# EAGLE design Maduino Power Line Modem  v1.2 (EAGLE 6.1)
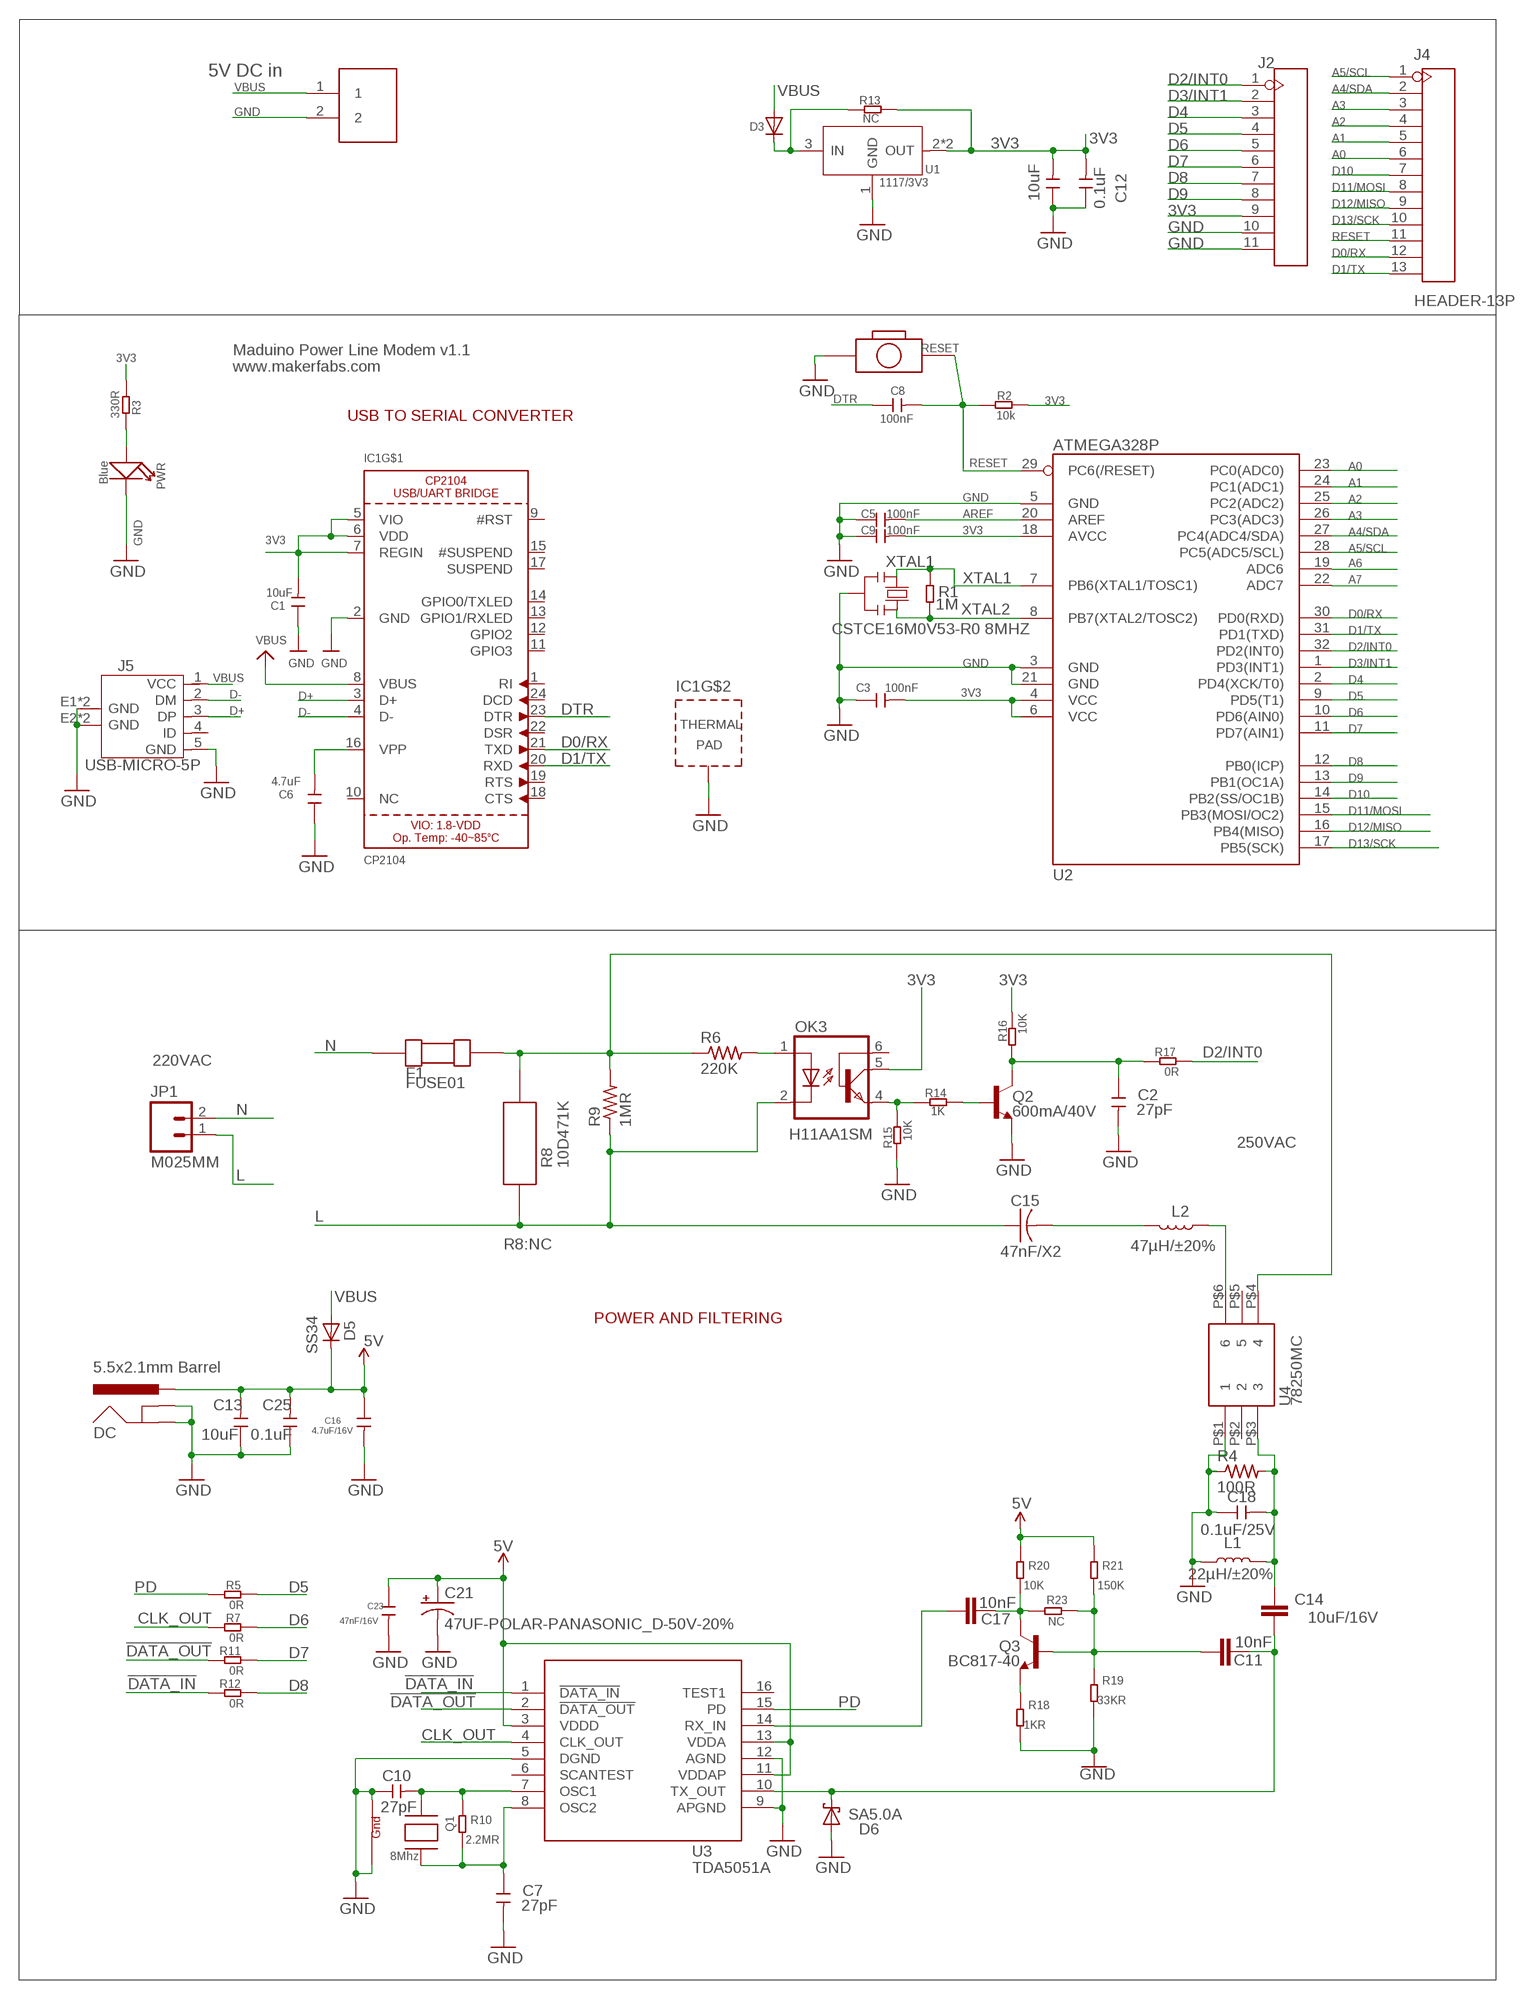
[diagram p0: schematic, sheet 1]

## Parts
C1  10uF  C-0603  [0603]
C2  27pF  C-0603  [0603]
C3  100nF  C-0603  [0603]
C4  10uF  C-0603  [0603]
C5  100nF  C-0603  [0603]
C6  4.7uF  C-0603  [0603]
C7  27pF  C-0603  [0603]
C8  100nF  C-0603  [0603]
C9  100nF  C-0603  [0603]
C10  27pF  C-0603  [0603]
C11  10nF  10NF-0603-50V-10%  [0603]
C12  0.1uF  C-0603  [0603]
C13  10uF  C-0603  [0603]
C14  10uF/16V  10NF-0603-50V-10%  [0603]
C15  47nF/X2  C-US150-054X183  [C150-054X183]
C16  4.7uF/16V  C-0603  [0603]
C17  10nF  10NF-0603-50V-10%  [0603]
C18  0.1uF/25V  C-0603  [0603]
C21  47UF-POLAR-PANASONIC_D-50V-20%  [PANASONIC_D]
C23  47nF/16V  C-0603  [0603]
C25  0.1uF  C-0603  [0603]
D3  DIODESOD-323F  [SOD-323F]
D5  SS34  DIODE-DO-214AC  [DO-214AC]
D6  SA5.0A  SCHOTTKY-DIODEDO41  [DO41-10]
DC  5.5x2.1mm Barrel  POWER_JACKSMD  [POWER_JACK_SMD]
F1  FUSE01  [FUSE01]
IC1  CP2104  [QFN24_4MM_SMSC]
J1  PH2.0-2P-90-DIP  [PH2.0-2P-90-DIP]
J2  HEADER-11P-2.54  [11P-2.54]
J4  HEADER-13P  [13P-2.54]
J5  USB-MICRO-5P  [MICRO-USB-5P]
JP1  M025MM  [SCREWTERMINAL-5MM-2]
L1  22µH/±20%  INDUCTOR-CR75-68UH  [CR75]
L2  47µH/±20%  INDUCTOR-CR75-68UH  [CR75]
OK3  H11A1SM  [DIL6-SMD]
PWR  Blue  LED'0603'  [LED-0603]
Q1  8Mhz  XTAL-4-3225  [NX3225]
Q2  600mA/40V  TRANS_NPN-MMBT2222AL  [SOT23-3]
Q3  BC817-40  TRANS_NPN-MMBTA42  [SOT23-3]
R1  1M  R-0603  [R0603]
R2  10k  R-0603  [R0603]
R3  330R  R-0603  [R0603]
R4  100R  R-US_R1206  [R1206]
R5  0R  R-0603  [R0603]
R6  220K  R-US_R1206  [R1206]
R7  0R  R-0603  [R0603]
R8  10D471K  [DIP2-7.5MM]
R9  1MR  R-US_R1206  [R1206]
R10  2.2MR  R-0603  [R0603]
R11  0R  R-0603  [R0603]
R12  0R  R-0603  [R0603]
R13  NC  R-0603  [R0603]
R14  1K  R-0603  [R0603]
R15  10K  R-0603  [R0603]
R16  10K  R-0603  [R0603]
R17  0R  R-0603  [R0603]
R18  1KR  R-0603  [R0603]
R19  33KR  R-0603  [R0603]
R20  10K  R-0603  [R0603]
R21  150K  R-0603  [R0603]
R23  NC  R-0603  [R0603]
RESET  BOTTON-2P-90D  [2P-7.62X3.56-90D]
U1  1117/3V3  LD1117'SOT89'  [SOT89]
U2  ATMEGA328P  ATMEGA8/168/328  [TQFP32]
U3  TDA5051A  [SOT-162]
U4  78250MC  [SMD6-254-1270X900]
Y1  CSTCE16M0V53-R0 8MHZ  RESONATORMU  [RESONATOR]

## Nets
3V3: C1.2 C3.2 C4.2 C9.2 C12.2 IC1.5(VIO) IC1.6(VDD) IC1.7(REGIN) J2.9 OK3.5(COL) R2.1 R3.1 R13.1 R16.1 U1.2(OUT) U1.4(OUT) U2.4(VCC) U2.6(VCC) U2.18(AVCC)
5V: C13.2 C16.1 C21.+ C23.1 C25.2 D5.C DC.VIN0(PWR) R20.1 R21.1 U3.3(VDDD) U3.11(VDDAP) U3.13(VDDA)
!DATA_IN: R12.2 U3.1(!DATA_IN)
!DATA_OUT: R11.2 U3.2(!DATA_OUT)
A0: J4.6 U2.23(PC0(ADC0))
A1: J4.5 U2.24(PC1(ADC1))
A2: J4.4 U2.25(PC2(ADC2))
A3: J4.3 U2.26(PC3(ADC3))
A4/SDA: J4.2 U2.27(PC4(ADC4/SDA))
A5/SCL: J4.1 U2.28(PC5(ADC5/SCL))
A6: U2.19(ADC6)
A7: U2.22(ADC7)
AREF: C5.2 U2.20(AREF)
CLK_OUT: R7.2 U3.4(CLK_OUT)
D0/RX: IC1.21(TXD) J4.12 U2.30(PD0(RXD))
D1/TX: IC1.20(RXD) J4.13 U2.31(PD1(TXD))
D2/INT0: J2.1 R17.1 U2.32(PD2(INT0))
D3/INT1: J2.2 U2.1(PD3(INT1))
D4: J2.3 U2.2(PD4(XCK/T0))
D5: J2.4 R5.1 U2.9(PD5(T1))
D6: J2.5 R7.1 U2.10(PD6(AIN0))
D7: J2.6 R11.1 U2.11(PD7(AIN1))
D8: J2.7 R12.1 U2.12(PB0(ICP))
D9: J2.8 U2.13(PB1(OC1A))
D10: J4.7 U2.14(PB2(SS/OC1B))
D11/MOSI: J4.8 U2.15(PB3(MOSI/OC2))
D12/MISO: J4.9 U2.16(PB4(MISO))
D13/SCK: J4.10 U2.17(PB5(SCK))
D+: IC1.3(D+) J5.3(DP)
D-: IC1.4(D-) J5.2(DM)
DTR: C8.1 IC1.23(DTR)
GND: C1.1 C2.2 C3.1 C4.1 C5.1 C6.1 C7.2 C9.1 C10.1 C12.1 C13.1 C16.2 C18.1 C21.- C23.2 C25.1 D6.A DC.GND(GNDBREAK) DC.P$4(GND) IC1.2(GND) IC1.THERM(TP) J1.2 J2.10 J2.11 J5.5(GND) J5.E1(GND) J5.E2(GND) J5.P1(GND) J5.P2(GND) L1.P$1 PWR.- Q1.2(G2) Q1.4(G1) Q2.2(E) R4.1 R15.2 R18.2 R19.2 RESET.P$2 U1.1(GND) U2.3(GND) U2.5(GND) U2.21(GND) U3.5(DGND) U3.9(APGND) U3.12(AGND) U4.P$1 Y1.2
L: C15.1 JP1.1 OK3.2(C) R8.P$2 R9.1
N: F1.P$1 JP1.2
N$1: OK3.1(A) R6.2
N$2: C7.1 Q1.3(X2) R10.2 U3.8(OSC2)
N$3: C17.2 U3.14(RX_IN)
N$4: L2.P$1 U4.P$6
N$5: OK3.4(EMI) R14.2 R15.1
N$6: C14.1 C18.2 L1.P$2 R4.2 U4.P$3
N$7: PWR.+ R3.2
N$8: Q2.1(B) R14.1
N$9: C15.2 L2.P$2
N$10: C6.2 IC1.16(VPP)
N$11: C11.1 C14.2 D6.C U3.10(TX_OUT)
N$12: D3.C R13.2 U1.3(IN)
N$13: C17.1 Q3.3(C) R20.2 R23.1
N$14: C10.2 Q1.1(X1) R10.1 U3.7(OSC1)
N$15: C2.1 Q2.3(C) R16.2 R17.2
N$17: F1.P$2 R6.1 R8.P$1 R9.2 U4.P$4
N$18: C11.2 Q3.1(B) R19.1 R21.2 R23.2
N$19: Q3.2(E) R18.1
PD: R5.2 U3.15(PD)
RESET: C8.2 J4.11 R2.2 RESET.P$1 U2.29(PC6(/RESET))
VBUS: D3.A D5.A IC1.8(VBUS) J1.1 J5.1(VCC)
XTAL1: R1.2 U2.7(PB6(XTAL1/TOSC1)) Y1.1
XTAL2: R1.1 U2.8(PB7(XTAL2/TOSC2)) Y1.3
Unconnected: IC1.1(RI) IC1.9(#RST) IC1.10(NC) IC1.11(GPIO3) IC1.12(GPIO2) IC1.13(GPIO1/RXLED) IC1.14(GPIO0/TXLED) IC1.15(#SUSPEND) IC1.17(SUSPEND) IC1.18(CTS) IC1.19(RTS) IC1.22(DSR) IC1.24(DCD) J5.4(ID) OK3.6(BAS) U3.6(SCANTEST) U3.16(TEST1) U4.P$2 U4.P$5

## Notes on the sheet
- 5V DC in
- Maduino Power Line Modem v1.1
- www.makerfabs.com
- USB TO SERIAL CONVERTER
- 220VAC
- H11AA1SM
- 250VAC
- R8:NC
- POWER AND FILTERING

## Library data of the parts
C1-C10 C12 C13 C16 C18 C23 C25 = Discrete:C*: Ceramic Capacitors
C11 C17 = SparkFun-Capacitors:10NF: 0.01uF/10nF/10,000pF ceramic capacitors A capacitor is a passive two-terminal electrical component used to store electrical energy temporarily in an electric field. CAP-09321; PROD_ID: CAP-00867
C14 = SparkFun-Capacitors:10NF: 0.01uF/10nF/10,000pF ceramic capacitors A capacitor is a passive two-terminal electrical component used to store electrical energy temporarily in an electric field. CAP-09321; PROD_ID: CAP-00867; VALUE: 10nF
C15 = adafruit:C-US: CAPACITOR, American symbol
C21 = SparkFun-Capacitors:47UF-POLAR: 47µF polarized capacitors A capacitor is a passive two-terminal electrical component used to store electrical energy temporarily in an electric field.
D3 = adafruit:DIODE: Diode SMADIODE - SMA Surface Mount Package 20V 1A Schottky Diode Digikey: 641-1014-6-ND DO-1N4148 - Through Hole Small Current Diode SOD-123 20V 1 A (.5mV Vf) Schottky Diode - Digikey: MBRX120TPMSCT-ND SOD-323 10V 570mA (.38mV Vf, 3ns) Schottky Diode - Digikey: ZLLS410CT-ND SOD-523 30V 30mA Schottky Diode (RB751S-40TE61) - Digikey: RB751S-40TE61CT-ND SOT23-R/W - SOT23 Package (R = Solder Paste/Reflow Ovens, W = Hand-Soldering) BAT54Film 40V 300mA - Digikey: 497-7162-1-ND
D5 = diode:DIODE-: DIODE
D6 = adafruit:SCHOTTKY-DIODE: Schottky Diode
DC = SparkFun-Connectors:POWER_JACK: Power Jack Connector This is the standard 5.5mm barrel jack for power. The PTH is the most common, proven, reliable, footprint. The Slot footprint only works if the mill layer is transmitted to the PCB fab house so be warned. Here are the connectors we sell at SparkFun: DC Barrel Power Jack/Connector <https://www.sparkfun.com/products/119> (PRT-00119) DC Barrel Power Jack/Connector (SMD) <https://www.sparkfun.com/products/12748> (PRT-12748) DC Barrel Jack Adapter - Breadboard Compatible <https://www.sparkfun.com/products/10811> (PRT-10811) It is used on this SparkFun product (and many, many others): SparkFun RedBoard - Programmed with Arduino <https://www.sparkfun.com/products/12757> (DEV-12757) Also, if you need a mating power supply or connector, please check these out: Wall Adapter Power Supply - 9VDC 650mA <https://www.sparkfun.com/products/298> (TOL-00298) DC Barrel Jack Adapter - Male <https://www.sparkfun.com/products/10287> (PRT-10287); PROD_ID: CONN-08106; SF_ID: PRT-12748
F1 = FUSE01:FUSE01: FUSE
IC1 = microbuilder:CP2104: CP2104 - USB to UART Bridge VDD Output: 3.45V
J1 = Connector:PH2.0-2P-90-DIP
J2 = Connector:HEADER-11P
J4 = Connector:HEADER-13P
J5 = Connector:USB-MICRO-5P
JP1 = SparkFun-Connectors:M02: Standard 2-pin 0.1" header. Use with - straight break away headers ( PRT-00116) - right angle break away headers (PRT-00553) - swiss pins (PRT-00743) - machine pins (PRT-00117) - female headers (PRT-00115) Molex polarized connector foot print use with: PRT-08233 with associated crimp pins and housings. 2.54_SCREWTERM for use with PRT-10571. 3.5mm Screw Terminal footprints for PRT-08084 5mm Screw Terminal footprints for use with PRT-08432; STOREFRONT_ID: PRT-08432
L1 L2 = SparkFun-Coils:INDUCTOR: Inductors Resist changes in electrical current. Basically a coil of wire. SparkFun Products: SparkFun Load Cell Amplifier - HX711 <https://www.sparkfun.com/products/13879> IOIO-OTG - V2.2 <https://www.sparkfun.com/products/13613>; PROD_ID: NDUC-09739; VALUE: 68µH/±20%/1.05A
OK3 = optocoupler:H11A*?M: General Purpose 6-Pin Phototransistor Optocouplers Source: http://www.fairchildsemi.com/ds/4N/4N35-M.pdf; OC_FARNELL: unknown; OC_NEWARK: unknown
PWR = Discrete:LED*
Q1 = adafruit:XTAL-4: Classic 4-pin 3.2 x 2.5mm crystal
Q2 = SparkFun-DiscreteSemi:TRANS_NPN: NPN transistor Current controlled devices typically used to amplify current or used as a switch. BC547 - COM-08928 <http://www.sparkfun.com/products/8928> (TO-92 45V 100mA) (1.Collector 2.Base 3.Emitter) 2N3904 - COM-00521 <http://www.sparkfun.com/products/521> (TO-92 40V 200mA) (1.Emitter 2.Base 3.Collector) P2N2222A - COM-12852 <http://www.sparkfun.com/products/12852> (TO-92 40V 600mA) (1.Collector 2.Base 3.Emitter); PROD_ID: TRANS-08049
Q3 = SparkFun-DiscreteSemi:TRANS_NPN: NPN transistor Current controlled devices typically used to amplify current or used as a switch. BC547 - COM-08928 <http://www.sparkfun.com/products/8928> (TO-92 45V 100mA) (1.Collector 2.Base 3.Emitter) 2N3904 - COM-00521 <http://www.sparkfun.com/products/521> (TO-92 40V 200mA) (1.Emitter 2.Base 3.Collector) P2N2222A - COM-12852 <http://www.sparkfun.com/products/12852> (TO-92 40V 600mA) (1.Collector 2.Base 3.Emitter); PROD_ID: TRANS-09116; VALUE: 500mA/300V
R1-R3 R5 R7 R10-R21 R23 = Discrete:R*
R4 R6 R9 = adafruit:R-US_: RESISTOR, American symbol
R8 = user01:10D471K: 10D471K
RESET = Discrete:BOTTON-2P
U1 = IC:LD1117: Low Drop Fixed And Adjustable Positive Voltage Regulators http://www.datasheetcatalog.org/datasheet/SGSThomsonMicroelectronics/mXuqtqv.pdf
U2 = IC:ATMEGA8/168/328: MICROCONTROLLER
U3 = self:TDA5051A
U4 = user01:78250MC
Y1 = SmartPrj:RESONATOR

## Net classes
0 default: width 0.203 mm
2 gnd: width 0.305 mm, drill 0.559 mm, clearance 0.254 mm
3 usbvcc: width 0.508 mm, drill 0.61 mm, clearance 0.254 mm

## Board
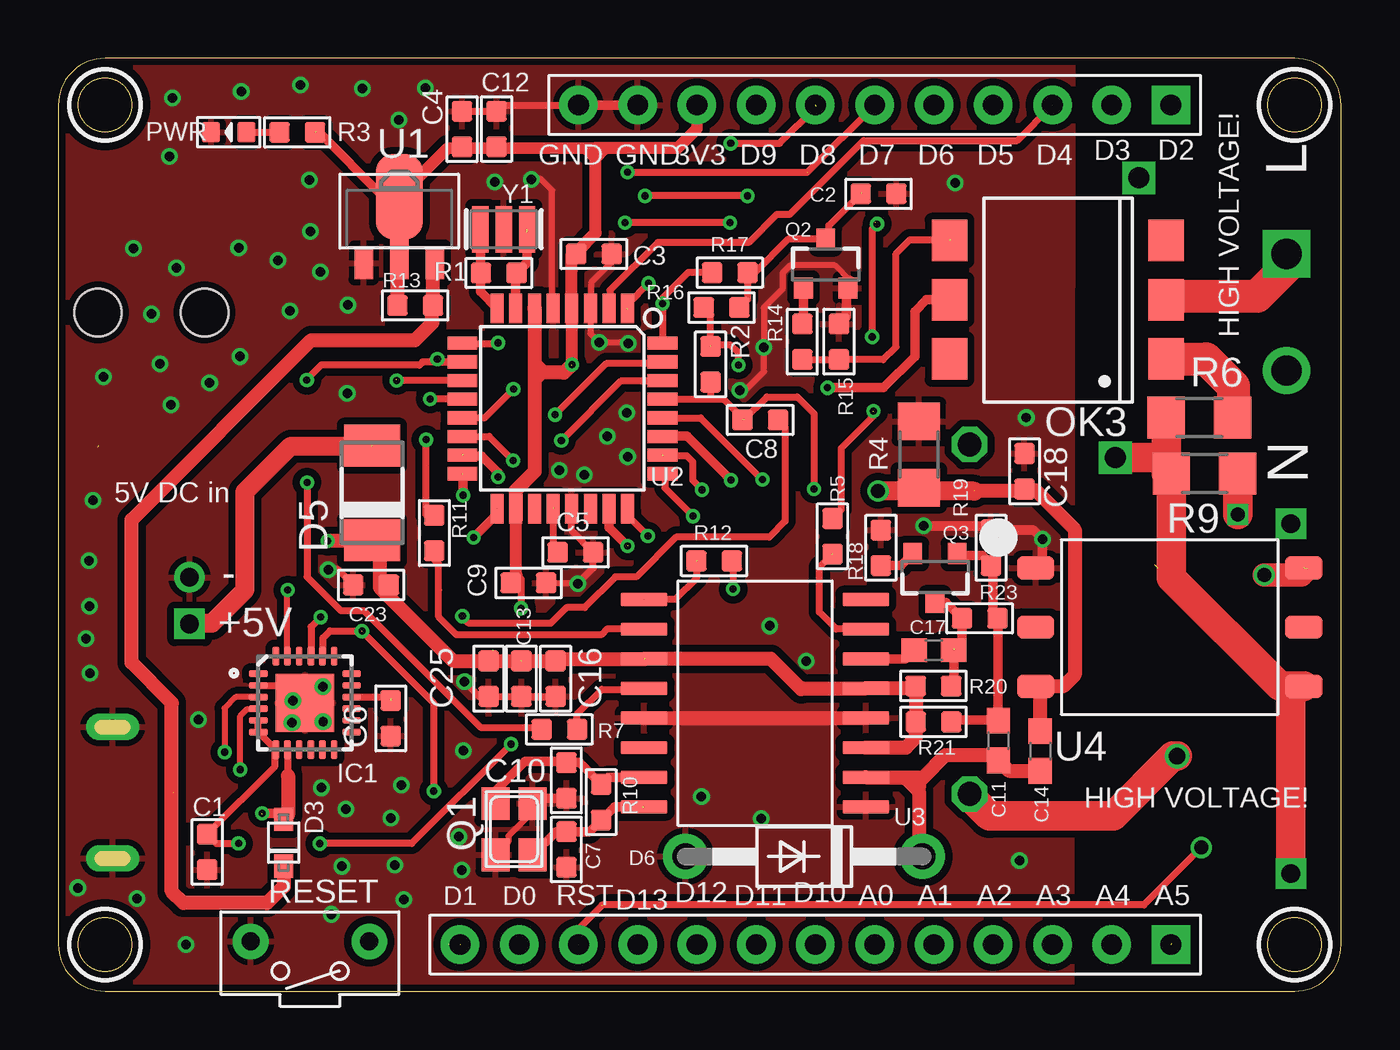
[diagram p1: board, top side]
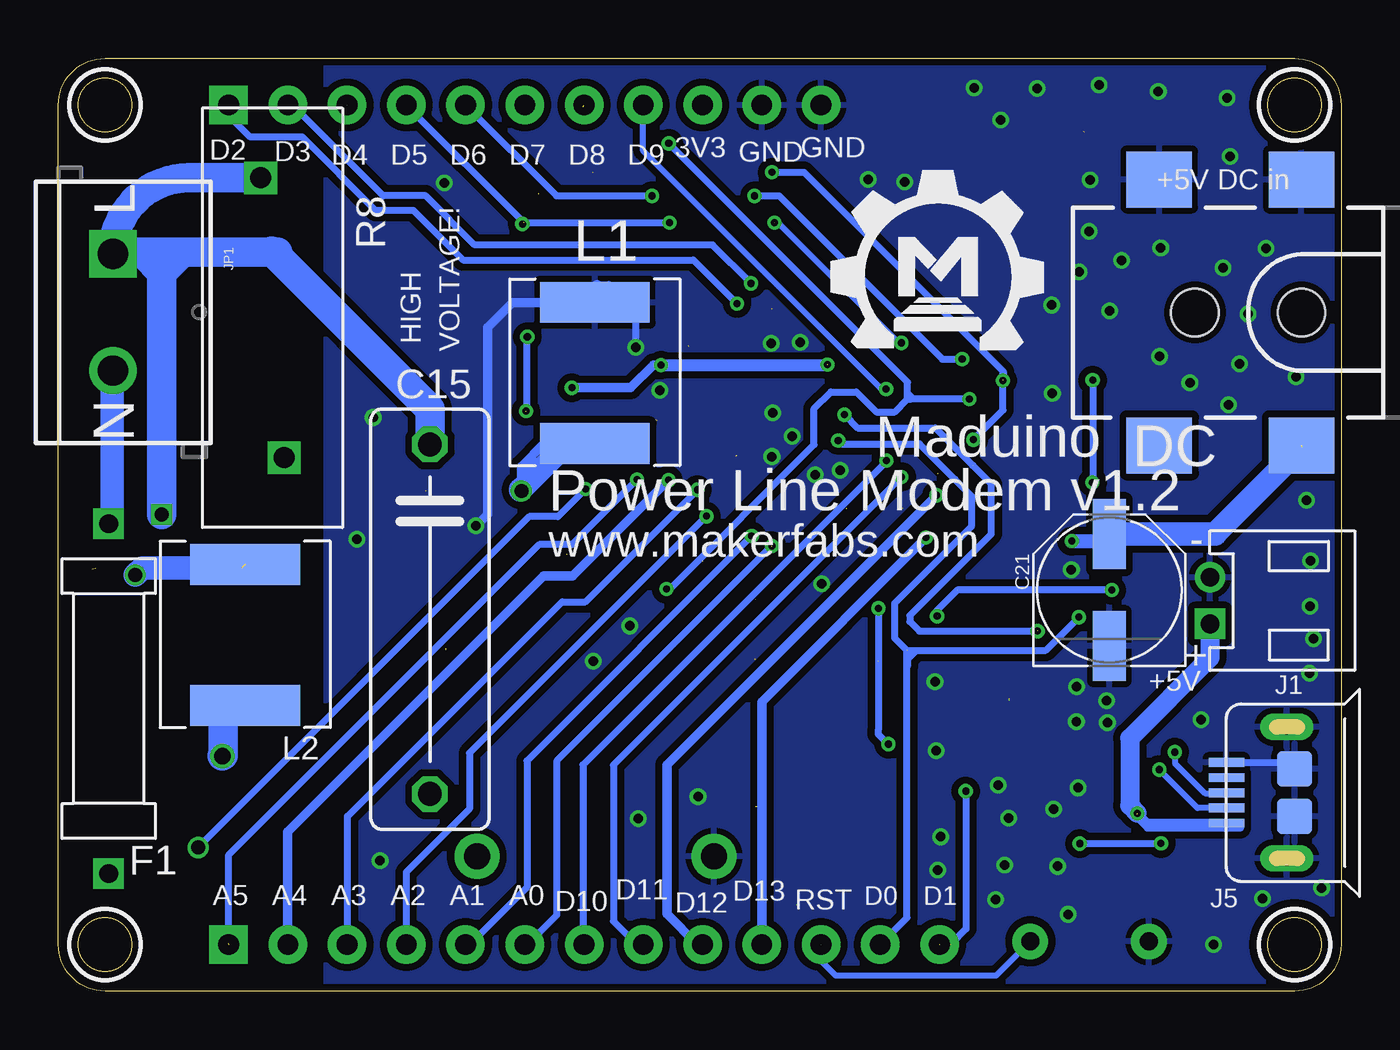
[diagram p2: board, bottom side, seen from below]

Size 55 x 40 mm. Coordinates in mm from the lower left corner, seen from the top.
Outline: 0,38 0,2 arc90 2,0 53,0 arc90 55,2 55,38 arc90 53,40 2,40 arc90 0,38
Outline: circle at 53,2 radius 1.14
Outline: circle at 53,38 radius 1.14
Outline: circle at 2,2 radius 1.14
Outline: circle at 2,38 radius 1.14
Copper layers (1*16): Top 0.035mm / dielectric 1.5mm / Bottom 0.035mm
Design rules: minimum track width 6mil, minimum drill 12mil, track to track 6mil, track to pad 6mil, pad to pad 6mil, via to via 6mil, smd to smd 0mil, copper to edge 10mil, drill to drill 10mil, minimum pad ring 10mil, minimum via ring 6mil, stop-mask expansion 2mil, vias tented up to drill 100mil, thermal gap 10mil
tRestrict: area 51.5,0.5 to 54.5,3.5; area 51.5,36.5 to 54.5,39.5; area 0.5,0.5 to 3.5,3.5; area 0.5,36.5 to 3.5,39.5
bRestrict: area 51.5,0.5 to 54.5,3.5; area 51.5,36.5 to 54.5,39.5; area 0.5,0.5 to 3.5,3.5; area 0.5,36.5 to 3.5,39.5

### Footprints (pad centres in the part's own frame; a part is rotated, then mirrored left to right if it is on the bottom)
0603 = smd 0.889 x 0.889: 1 -0.762,0; 2 0.762,0
0603' = smd 1.1 x 1: 1 -0.85,0; 2 0.85,0
C150-054X183 = drill 1.016 octagon: 1 -7.493,0; 2 7.493,0
PANASONIC_D = smd 3 x 1.4: + 2.4,0; - -2.4,0
SOD-323F = smd 1 x 0.8: A -1,0; C 1,0
DO-214AC = smd 1.8 x 2.4: A 2.025,0; C -2.025,0
DO41-10 = drill 1.118 pad 1.93: A 5.08,0; C -5.08,0
POWER_JACK_SMD = smd 2.8 x 2.4: GND 0,-5.7; P$4 6.1,-5.7; VIN0 0,5.7; VIN1 6.1,5.7 | hole 2.032: 0,0; 4.572,0
FUSE01 = drill 0.8 square: P$1 -7.5,0; P$2 7.5,0
QFN24_4MM_SMSC = smd 0.8 x 0.28: 1 -2,1.25; 2 -2,0.75; 3 -2,0.25; 4 -2,-0.25; 5 -2,-0.75; 6 -2,-1.25; 13 2,-1.25; 14 2,-0.75; 15 2,-0.25; 16 2,0.25; 17 2,0.75; 18 2,1.25 | smd 0.28 x 0.8: 7 -1.25,-2; 8 -0.75,-2; 9 -0.25,-2; 10 0.25,-2; 11 0.75,-2; 12 1.25,-2; 19 1.25,2; 20 0.75,2; 21 0.25,2; 22 -0.25,2; 23 -0.75,2; 24 -1.25,2 | smd 2.5 x 2.5: THERM 0,0
PH2.0-2P-90-DIP = drill 0.8 square: 1 0,1 | drill 0.8: 2 0,-1
11P-2.54 = drill 0.889 pad 1.651 square: 1 0,12.7 | drill 0.889 pad 1.651: 2 0,10.16; 3 0,7.62; 4 0,5.08; 5 0,2.54; 6 0,0; 7 0,-2.54; 8 0,-5.08; 9 0,-7.62; 10 0,-10.16; 11 0,-12.7
13P-2.54 = drill 0.889 pad 1.651 square: 1 0,15.24 | drill 0.889 pad 1.651: 2 0,12.7; 3 0,10.16; 4 0,7.62; 5 0,5.08; 6 0,2.54; 7 0,0; 8 0,-2.54; 9 0,-5.08; 10 0,-7.62; 11 0,-10.16; 12 0,-12.7; 13 0,-15.24
MICRO-USB-5P = smd 0.38 x 1.52: 1 -1.3,0; 2 -0.65,0; 3 0,0; 4 0.65,0; 5 1.3,0 | smd 1.524 x 1.524: E1 -1.016,-2.921; E2 1.016,-2.921 | drill 0.635 pad 1.143 long: P1 -2.819,-2.591; P2 2.819,-2.591
SCREWTERMINAL-5MM-2 = drill 1.3 pad 2.032 square: 1 0,0 | drill 1.3 pad 2.032: 2 5,0
CR75 = smd 1.75 x 4.7: P$1 -3.025,0; P$2 3.025,0
DIL6-SMD = smd 1.78 x 1.52: 1 -2.54,-4.645; 2 0,-4.645; 3 2.54,-4.645; 4 2.54,4.645; 5 0,4.645; 6 -2.54,4.645
LED-0603 = smd 0.762 x 0.889: + -0.762,0; - 0.762,0
NX3225 = smd 1.4 x 1.2: 1 -1.1,-0.8; 2 1.1,-0.8; 3 1.1,0.8; 4 -1.1,0.8
SOT23-3 = smd 0.8 x 0.9: 1 -0.95,-1; 2 0.95,-1; 3 0,1.1
R0603 = smd 0.889 x 0.889: 1 -0.762,0; 2 0.762,0
R1206 = smd 1.6 x 1.803: 1 -1.422,0; 2 1.422,0
DIP2-7.5MM = drill 0.9 square: P$1 0,-0.5; P$2 12,0.5
2P-7.62X3.56-90D = drill 0.762 pad 1.524: P$1 0,2.54; P$2 0,-2.54
SOT89 = smd 0.8 x 1.4: 1 -1.524,-1.905; 3 1.524,-1.905 | smd 0.8 x 1.9: 2 0,-1.651 | smd 2.032 x 3.65: 4 0,0.94
TQFP32 = smd 1.27 x 0.559: 1 -4.293,2.8; 2 -4.293,2; 3 -4.293,1.2; 4 -4.293,0.4; 5 -4.293,-0.4; 6 -4.293,-1.2; 7 -4.293,-2; 8 -4.293,-2.8; 17 4.293,-2.8; 18 4.293,-2; 19 4.293,-1.2; 20 4.293,-0.4; 21 4.293,0.4; 22 4.293,1.2; 23 4.293,2; 24 4.293,2.8 | smd 0.559 x 1.27: 9 -2.8,-4.293; 10 -2,-4.293; 11 -1.2,-4.293; 12 -0.4,-4.293; 13 0.4,-4.293; 14 1.2,-4.293; 15 2,-4.293; 16 2.8,-4.293; 25 2.8,4.293; 26 2,4.293; 27 1.2,4.293; 28 0.4,4.293; 29 -0.4,4.293; 30 -1.2,4.293; 31 -2,4.293; 32 -2.8,4.293
SOT-162 = smd 2 x 0.58: 1 -4.75,4.445; 2 -4.75,3.175; 3 -4.75,1.905; 4 -4.75,0.635; 5 -4.75,-0.635; 6 -4.75,-1.905; 7 -4.75,-3.175; 8 -4.75,-4.445; 9 4.75,-4.445; 10 4.75,-3.175; 11 4.75,-1.905; 12 4.75,-0.635; 13 4.75,0.635; 14 4.75,1.905; 15 4.75,3.175; 16 4.75,4.445
SMD6-254-1270X900 = smd 1.6 x 1: P$1 0,0; P$2 0,-2.54; P$3 0,-5.08; P$4 11.5,-5.08; P$5 11.5,-2.54; P$6 11.5,0
RESONATOR = smd 0.7 x 2: 1 -1,0; 2 0,0; 3 1,0

### Placement (x,y rotation side)
C1  6.38,5.97 90 top
C2  35.17,34.19 0 top
C3  22.96,31.61 180 top
C4  17.31,36.96 270 top
C5  22.17,18.81 180 top
C6  14.25,11.7 90 top
C7  21.78,6.08 270 top
C8  30.1,24.49 180 top
C9  20.16,17.51 180 top
C10  21.79,9.04 90 top
C11  10nF  [0603']  40.31,10.75 90 top
C12  18.79,36.97 270 top
C13  19.85,13.4 90 top
C14  10uF/16V  [0603']  42.09,10.3 270 top
C15  39.07,15.95 270 bottom
C16  21.32,13.4 270 top
C17  10nF  [0603']  37.54,14.63 180 top
C18  41.43,22.29 270 top
C21  9.94,17.2 90 bottom
C23  13.41,17.42 180 top
C25  18.45,13.4 90 top
D3  9.66,6.37 270 top
D5  13.45,21.37 90 top
D6  31.98,5.77 180 top
DC  1.7,29.1 180 bottom
F1  52.84,12.55 270 bottom
IC1  10.58,12.36 0 top
J1  5.62,16.75 180 bottom
J2  35,38 270 top
J4  32.46,2 270 top
J5  4.92,8.51 90 bottom
JP1  52.66,31.61 270 bottom
L1  32,26.51 270 bottom
L2  46.99,15.28 270 bottom
OK3  42.86,29.65 90 top
PWR  7.3,36.83 180 top
Q1  19.54,6.95 270 top
Q2  32.9,31.15 0 top
Q3  37.59,17.76 180 top
R1  18.88,30.79 0 top
R2  27.96,26.88 270 top
R3  10.24,36.82 180 top
R4  36.9,23.01 270 top
R5  33.19,19.51 270 top
R6  48.92,24.6 0 top
R7  21.48,11.23 0 top
R8  45.82,22.87 90 bottom
R9  49.14,22.19 180 top
R10  23.27,8.11 270 top
R11  16.12,19.64 270 top
R12  28.12,18.45 180 top
R13  15.3,29.4 0 top
R14  31.9,27.85 270 top
R15  33.47,27.85 90 top
R16  28.43,29.31 0 top
R17  28.79,30.81 0 top
R18  35.27,19.01 90 top
R19  39.99,19.01 90 top
R20  37.52,13.09 0 top
R21  37.52,11.55 0 top
R23  39.5,15.99 0 top
RESET  10.79,2.14 270 top
U1  14.62,33.13 0 top
U2  21.61,24.98 270 top
U3  29.87,12.35 0 top
U4  41.9,18.15 0 top
U$1  [MAKERFABS_0.3]  21.41,27.56 0 bottom
Y1  19.1,32.67 180 top

### Tracks (layer width: path | path; a pad name or v marks a point on that pad's centre or on a via)
3V3  (via drill 0.3)  (4 unrouted)
  Top 0.254: U1.2 14.62,32.95 14.59,32.98 14.62,33.01 14.62,33.28 | U1.4 14.62,33.28 | 14.54,31.94 14.54,33.2 14.62,33.28 | C9.2 19.43,17.51 19.44,17.51 19.44,17.59 19.65,17.8 19.65,17.7 19.84,17.5
  Top 0.305: IC1.5 IC1.6 IC1.7 9.29,10.33 9.29,9.65 C1.2 6.78,6.34 v7.73,6.34 | C12.2 C4.2 17.26,36.15 17.23,36.15 | 19.84,17.66 19.84,17.5 v19.84,16.42 | v19.41,10.59 15.15,6.33 v11.21,6.33 | 20.46,27.09 20.98,26.57 20.45,26.03 20.45,26.5 | 20.45,26.5 20.45,26.8 20.44,26.8 20.48,26.8 | 20.42,26.52 20.45,26.5 | v29.16,26.85 29.16,27.37 28.82,27.71 28.01,27.71 27.98,27.68 | R2.1 27.96,29.02 R16.1
  Top 0.406: U1.4 13.93,34.07 11.15,36.85 11.05,36.85 10.95,36.75 | 23.04,36.15 22.58,36.15 22.58,36.12 22.57,36.12 22.57,36.13 22.59,36.13 | 22.59,36.13 22.57,36.13 | U2.18 19.58,20.69 19.58,20.23 19.6,20.23 19.6,20.25 19.62,20.25 19.62,20.22 19.63,20.22 19.63,20.24 19.61,20.24 | v32.98,25.87 35.38,25.87 36.72,27.21 36.72,29.14 37.22,29.65 OK3.5 | 22.59,36.13 22.64,36.13 22.64,36.11
  Top 0.5: U1.4 16.7,36.15 17.23,36.15 23.04,36.15 | 26.55,36.15 27.38,36.98 J2.9
  Top 0.508: U2.18 19.61,17.85 | 19.61,17.85 19.59,17.82 | 19.61,17.85 19.62,17.86 19.62,17.83 19.65,17.8 | U2.6 | 23.04,36.15 23.04,32.52 22.21,31.69 22.21,31.6 C3.2 22.2,31.59 22.01,31.59 22.01,30.92 22,30.92 U2.4 22.02,29.27 22.02,29.26 22.03,29.25 v22.03,26.86 | 26.55,36.15 23.03,36.15 | 22.64,36.14 22.64,36.11 23.02,35.72 23.04,35.72 23.43,36.11 | 22.01,26.86
  Top 0.61: R13.1 14.54,31.94 14.6,32 | U2.6 20.42,29.27 20.42,26.52 | 20.42,26.52 20.42,22.29 19.61,21.48 19.61,20.24 | 22.01,26.86 21.68,26.52 20.42,26.52
  Top 0.813: 14.51,29.43 R13.1
  Bottom 0.305: v19.84,16.42 19.84,11.2 19.85,11.19 19.85,11.03 v19.42,10.59 v19.41,10.59 | v11.21,6.33 v11.2,6.34 v7.73,6.34
  Bottom 0.406: v32.98,25.87 30.46,25.87 29.49,26.85 v29.16,26.85
  Bottom 0.508: v29.16,26.85 22.05,26.85 v22.03,26.86
5V  (via drill 0.3)  (3 unrouted)
  Top 0.305: 13.77,17.32 14.07,17.32 C23.1 13.88,17.42 13.78,17.31
  Top 0.406: U3.13 34.72,13.09 | R21.1 | C25.2 C13.2
  Top 0.61: v11.55,19.3 13.35,19.3 13.39,19.34 D5.C 13.31,19.2 | 13.31,19.2 13.15,19.2 | R20.1 36.65,12.98 | 36.65,12.98 U3.13 31.88,12.98 31.85,12.95 30.55,14.25 25.15,14.25 25.13,14.23 21.39,14.23 C16.1 C25.2 16.93,14.16 13.78,17.31 13.78,18.73 13.31,19.2 | 36.65,12.98 36.76,12.87 R21.1 36.76,10.87 36.34,10.45 34.63,10.45 U3.11
  Bottom 0.406: 10,19.4 9.94,19.4 C21.+
  Bottom 0.61: v11.55,19.3 10.1,19.3 10,19.4
  Bottom 1.016: C21.+ 5.4,19.6 5.4,19.62 1.69,23.32
!DATA_IN  (2 unrouted)
  Top 0.305: 27.37,18.44 27.37,17.73 26.44,16.8 U3.1
!DATA_OUT
  Top 0.305: U3.2 23.52,15.52 23.28,15.28 17.07,15.28 16.31,16.05 16.31,18.3 15.98,18.63 | 15.98,18.63 15.84,18.77 | R11.2 16.12,18.79 16.12,18.77 15.98,18.63
A0  (via drill 0.3)  (1 unrouted)
  Top 0.254: U2.23 23.61,20.66 23.55,20.6
  Top 0.406: 23.65,20.5 23.55,20.6 | v24.41,19.09 23.61,19.89 U2.23
  Bottom 0.305: v24.41,19.08 33.63,9.87 33.63,3.26 34.88,2.01 J4.6
A1  (via drill 0.3)
  Top 0.305: U2.24 24.53,20.57 24.53,20.26 v25.27,19.52
  Bottom 0.305: 37.39,1.98 37.54,1.98 | 37.54,1.98 37.56,2 37.57,2 37.55,2.02 37.5,2.02 37.49,2 37.49,1.97 | v25.27,19.52 34.91,9.88 34.91,4.46 37.36,2 J4.5 37.54,1.98
A2  (via drill 0.3)
  Top 0.305: U2.25 26,22.09 26,21.58 v27.21,20.37
  Bottom 0.305: v27.21,20.37 37.37,10.21 37.37,7.82 40.08,5.1 J4.4 | 40.08,1.95 J4.4 | J4.4
A3  (via drill 0.3)  (1 unrouted)
  Top 0.305: v27.6,21.5 27.2,21.9 27.2,22.7 26.95,22.95 25.95,22.95
  Bottom 0.305: J4.3 42.6,2.02 42.6,7.5 33.4,16.7 32.4,16.7 v27.6,21.5
A4/SDA  (via drill 0.3)
  Top 0.254: U2.27
  Top 0.406: v28.84,21.91 26.95,23.8 25.88,23.8 U2.27
  Bottom 0.406: J4.2 45.16,6.84 34.2,17.8 32.95,17.8 v28.84,21.91
A5/SCL  (via drill 0.3)  (1 unrouted)
  Top 0.305: U2.28 25.91,24.58 27.54,24.58 30.18,21.94 v30.19,21.94
  Bottom 0.305: v30.19,21.94 32.98,19.15 34.39,19.15 47.71,5.82 47.71,2.04
AREF  (1 unrouted)
  Top 0.305: C5.2 21.23,18.99 21.23,20.72
CLK_OUT
  Top 0.305: R7.2 22.24,11.89 23.3,12.95 25.09,12.95 25.1,12.96 25.1,12.97 U3.4
D0/RX  (via drill 0.3)  (1 unrouted)
  Top 0.305: U2.30 25.87,26.15 24.11,26.15 v21.57,23.61 | v11.24,16.04 10.83,15.63 IC1.21 | IC1.21 10.83,14.32 | 10.83,14.38 IC1.21
  Bottom 0.305: v21.57,23.61 21.42,23.47 18.7,23.47 18.7,23.46 18.08,23.46 16.56,21.94 | v11.24,16.04 v11.24,16.03 12.66,14.62 18.62,14.62 19.15,15.14 19.15,16.63 15.83,19.95 15.83,21.21 16.55,21.93 16.56,21.93 16.56,21.94 | J4.12 18.61,3.15 18.61,14.63 18.59,14.61 18.21,14.61 18.6,14.22 18.6,13.92 | 16.56,21.94
D1/TX  (via drill 0.3)  (4 unrouted)
  Top 0.305: IC1.20 11.35,14.39 11.35,15.15 11.65,15.45 13,15.45 16.1,12.35 v16.1,8.58 | U2.31 25.83,26.91 23.49,26.91 v21.3,24.72 | v13.02,15.44 13.01,15.43 13.01,15.41
  Bottom 0.305: v21.3,24.72 20.73,24.15 17.4,24.15 15.79,22.54 | v13.02,15.44 18.09,15.44 18.5,15.85 18.5,16.1 15,19.6 15,21.75 15.78,22.54 15.79,22.54 | v16.1,8.58 16.08,8.57 16.08,2.67 16.73,2.01 | 17.22,2.01 17.23,2.03 | J4.13 17.21,2.01 16.75,2.01
D2/INT0  (via drill 0.3)
  Top 0.305: 25.91,27.8 25.92,27.79 | 25.91,27.8 U2.32 25.91,27.71 | 25.91,27.8 25.9,27.81 | R17.1 28.02,30.83 27.01,30.83 25.9,29.72 v25.9,29.48 v25.91,29.48 25.91,27.71 | 25.91,27.71
  Bottom 0.305: v25.9,29.48 27.77,31.35 37.65,31.35 37.65,31.36 39.77,33.48 41.39,33.48 44.53,36.62 46.77,36.62 47.7,37.55 J2.1
D3/INT1  (via drill 0.3)  (1 unrouted)
  Top 0.305: v25.3,30.35 24.4,29.45 24.4,29.25
  Bottom 0.305: v25.3,30.35 26.95,32 37.15,32 39.25,34.1 41.07,34.1 44.93,37.97 45.14,37.97 45.16,37.99 J2.2 45.2,37.96 45.23,37.96
D4  (1 unrouted)
  Top 0.305: U2.2 23.65,29.32 23.65,30.05 25.7,32.1 29.6,32.1 30.8,33.3 31.35,33.3 33.26,35.21 34.53,36.48 41.11,36.48 42.62,37.99
D5  (via drill 0.3)  (3 unrouted)
  Top 0.254: U2.9 17.35,27.75
  Top 0.305: v28.8,32.95 v24.3,32.95 | v18.85,27.8 18.8,27.75 17.35,27.75 | R5.1 33.56,20.65 33.56,23.27 34.95,24.66 v34.95,24.86 | v34.89,28.06 34.89,32.69 v35.1,32.9 35.12,32.9 35.12,32.89 35.09,32.89 35.07,32.9
  Bottom 0.254: v18.85,27.8 18.97,27.8 24.14,32.96 24.29,32.96 v24.3,32.95
  Bottom 0.305: J2.4 35.03,32.95 v28.8,32.95 | v35.1,32.9 35.03,32.98 | v34.95,24.87 34.89,24.93 v34.89,28.06
D6  (via drill 0.3)
  Top 0.305: v29.55,34.1 v25.15,34.1 | v16.25,27.1 16.36,26.98 U2.10 15.62,26.98 15.47,26.84 15.46,26.85 11.28,26.85 10.65,26.23 v10.65,26.2 | v10.67,21.81 10.67,17.77 12.12,16.31 13.1,16.31 18.1,11.32 20.63,11.32 R7.1
  Bottom 0.305: J2.5 33.64,34.1 v29.55,34.1 | v25.15,34.1 24.1,34.1 17.1,27.1 v16.25,27.1 | v10.65,26.2 10.65,21.83 v10.67,21.81
D7  (via drill 0.3)  (3 unrouted)
  Top 0.305: J2.6 32.1,35.1 | U2.11 v14.51,26.18 | v24.4,35.12 v24.41,35.11 32.09,35.11 | 15.8,23.61 v15.76,23.64 15.76,23.63 15.77,23.63 15.77,20.41 R11.1
  Bottom 0.305: v24.4,35.12 v24.39,35.11 23.02,35.11 14.49,26.57 14.49,26.45 | 14.49,26.45 14.49,26.21 | 14.51,26.26 14.51,26.48 14.49,26.45 | v15.76,23.64 14.5,24.91 14.5,26.23 | v14.51,26.18 v14.5,26.19 14.5,26.21
D8  (via drill 0.3)  (1 unrouted)
  Top 0.305: R12.1 28.93,18.45 v28.93,17.24 | v28.83,36.35 30.92,36.35 32.5,37.93 | U2.12 v15.95,25.39 v15.94,25.39
  Bottom 0.254: 18.4,25.44 | 18.6,25.38 18.61,25.38 18.62,25.39
  Bottom 0.305: v28.93,17.24 28.78,17.24 22.6,23.43 22.6,24.98 21.88,25.7 20.79,25.7 19.93,24.84 19.13,24.84 18.59,25.38 | 18.59,25.38 18.59,26.12 v28.83,36.35 | v15.94,25.39 18.62,25.39 18.64,25.37 | 18.4,25.44 18.56,25.6 18.59,25.6 | 18.59,25.38 18.46,25.38 18.4,25.44 18.54,25.44 18.6,25.38
D9  (via drill 0.3)
  Top 0.254: 17.35,24.6 17.33,24.6
  Top 0.305: 17.33,24.6 U2.13 18.28,24.59 v19.51,25.82
  Bottom 0.254: v19.51,25.82 19.7,25.82 29.92,36.04 29.92,37.96 | 29.92,37.96 | 29.92,37.96 J2.8
D10  (via drill 0.3)
  Top 0.305: U2.14 18.47,23.79 v19.5,22.76
  Bottom 0.305: v19.5,22.76 19.5,22.72 32.51,9.71 32.51,2.21 32.36,2.06 32.4,2.06 J4.7
D11/MOSI  (via drill 0.3)  (1 unrouted)
  Top 0.406: 17.35,23 17.4,22.95 18.15,22.95 18.85,22.25 v18.85,22.05
  Bottom 0.305: v18.85,22.05 31.2,9.7 31.2,3 30.2,2 J4.8
D12/MISO  (via drill 0.3)  (1 unrouted)
  Top 0.406: v17.35,21.26 17.35,22.15 17.3,22.2 17.35,22.2
  Bottom 0.406: v17.35,21.26 28.91,9.71 28.91,3.32 27.59,2 J4.9
D13/SCK  (via drill 0.3)  (1 unrouted)
  Top 0.406: v17.8,19.45 18.9,20.55 18.9,20.6 U2.17 | 18.8,20.75 U2.17 | U2.17 18.85,20.7
  Bottom 0.406: J4.10 24.84,12.41 v17.8,19.45
D+  (via drill 0.3)  (1 unrouted)
  Top 0.254: IC1.3 7.61,12.61 7.13,12.13 v7.13,10.25
  Bottom 0.254: v7.13,10.25 v7.13,10.24 7.13,9.77 5.84,8.48 4.95,8.48
D-  (via drill 0.3)
  Top 0.254: v7.8,9.5 7.8,11.8 8.1,12.1 8.56,12.1 IC1.4
  Bottom 0.254: J5.2 6.16,7.86 v7.8,9.5
DTR  (via drill 0.3)  (2 unrouted)
  Top 0.254: 9.81,17.21 9.81,14.1 9.82,14.09 9.83,14.09 IC1.23 | 9.81,17.21 v9.83,17.21 | v9.84,17.2 v9.82,17.21 9.81,17.21
  Top 0.305: C8.1 31.16,24.19 31.16,20.16 30.48,19.47 26.49,19.47 24.79,17.77 23.89,17.77 22.57,16.45 21.82,16.45 21.81,16.44 21.77,16.44 21.11,15.78 17.59,15.78 17.31,16.06 17.31,16.09
  Bottom 0.305: 16.46,17.2 17.32,16.34 v17.32,16.08 | v9.84,17.2 16.46,17.2
GND  (via drill 0.41)
  Top 0.254: C9.1 22.27,17.51 v22.27,17.47 | U2.5 21.18,29.28 21.18,34.34 20.68,34.84 20.3,34.84 | C3.1 23.72,31.26 22.86,30.39 22.86,29.32 U2.3 22.81,28.2 23.19,27.83 24.39,27.83 v24.44,27.78 24.43,27.78 24.41,27.77 24.41,27.78 24.43,27.8 | 33.92,30.49 33.29,31.13 31.38,31.13 31.05,30.8 31.05,30.11 30.24,29.3 v30.24,27.6 | v30.24,27.6 v30.25,27.6 30.26,27.59 30.26,26.57 29.45,25.76 v29.22,25.76 | v30.24,27.6 30.23,27.6 30.21,27.59 | Q1.4 20.34,7.69 19.3,6.65 19.3,6.41 Q1.2
  Top 0.305: 22,20.68 22,19.74 C5.1 22.93,18.14 v22.27,17.47 | IC1.2 10.46,13.11 10.51,13.07 | C4.1 C12.1 19.06,38 J2.11 24.8,38 24.83,38.03 22.38,38.03 | v17.42,13.27 18.04,12.64 C25.1 | 18.5,12.69 18.55,12.64 | 18.55,12.64 C13.1 | C13.1 C16.2 21.38,12.58 21.42,12.58 | 18.55,12.64 18.54,12.62 18.5,12.62 18.52,12.64 C13.1 | C13.1 19.88,12.61 21.39,12.61 21.38,12.6 21.37,12.6 | C23.2 11.99,18.08 v11.57,18.08 v11.58,18.07 11.59,18.07
  Top 0.406: 33.95,30.05 Q2.2 33.84,30.15 33.78,30.21 | J2.10 22.41,38 22.38,38.03 | C10.1 20.57,8.28 Q1.4 | v37.1,19.95 39.81,19.95 R19.2 41.8,19.77 v42.19,19.38 42.19,18.44 U4.P$1 | R15.2 33.78,28.93 33.78,30.21 | 33.78,30.21 33.92,30.35 33.92,30.49
  Top 0.61: C25.1 18.5,12.69 | U3.5 U3.12
  Bottom 0.305: J5.5 2.04,9.81 2.01,9.78 | 31.9,30.3 31.39,30.3 30.24,29.15 v30.24,27.6 v30.25,27.6
  Bottom 0.406: v37.1,19.95 36.6,20.45 36.6,28.45 35.52,29.54 L1.P$1 31.9,29.63 31.9,30.3
  other vias: 11.7,3.3 10.37,38.85 11.29,8.72 4.77,35.8 4.36,26.9 3.22,31.84 17.36,10.32 1.31,18.46 1.34,16.51 3.37,3.98 12.15,5.35 38.45,34.66 11.35,13.06 1.36,13.63 9.93,29.17 9.41,31.33 10.02,11.52 11.35,11.56 1.48,21.04 7.84,38.57 4.9,38.31 7.73,31.87 13.04,38.7 5.07,31.01 15.74,38.72 14.6,37.36 11.23,30.85 4.83,25.15 32.07,14.14 12.38,25.63 27.57,8.35 10.06,12.46 7.78,27.21 17.3,5.19 10.81,32.58 14.82,3.92 41.5,24.6 30.13,7.41 1.93,26.35 14.26,7.42 18.71,34.7 12.41,29.42 12.34,7.81 41.21,5.6 1.18,15.11 6,11.65 0.83,4.43 17.18,6.62 20.28,34.81 14.72,8.84 10.76,34.79 6.49,26.09 30.5,15.66 5.48,2.01 14.43,5.41 4,29.03 21.47,22.34 22.55,22.15 24.36,24.79 24.4,22.92 23.54,23.8 23.2,27.82
  pour Bottom (isolate 0.305): -1.27,-1.27 43.5,-1.22 43.5,40.56 -1.27,40.51
  pour Top (isolate 0.305): -1.27,-1.27 43.44,-1.17 43.49,40.58 -1.23,40.48
L  (via drill 0.6)
  Top 1.27: R9.1 v50.56,20.45 v50.57,20.43
  Top 1.422: OK3.2 47.65,29.8 51.4,29.8 52.67,31.08 52.67,31.6 JP1.1
  Bottom 1.016: 52.3,31.65 52.65,31.65 | 49.42,31.75 50.55,30.62 50.55,30.6 | 50.55,30.6 51.6,31.66 | 50.55,30.6 50.57,30.6 50.57,30.68
  Bottom 1.27: C15.1 39.07,24.96 45.8,31.69 | 45.8,31.69 45.89,31.69 | 45.89,31.69 50.76,31.69 | 50.76,31.69 52.35,31.69 52.51,31.53 52.3,31.53 52.3,31.65 | 45.85,31.73 45.89,31.69 | v50.57,20.43 50.57,30.68 50.57,31.51 50.76,31.69 | 45.8,31.69 45.59,31.69 | R8.P$2 49.4,34.87 arc-90 JP1.1
  Bottom 1.422: JP1.1 52.65,31.62 52.65,31.65
N
  Bottom 1.016: 52.7,26.7 52.6,26.7 52.6,26.63 52.61,26.62 52.62,26.62 | F1.P$1 52.69,20.2 52.69,26.55 | 52.69,26.55 52.7,26.54 | 52.69,26.55 52.62,26.62 | 52.62,26.62 52.62,26.68
  Bottom 1.422: JP1.2 52.64,26.63 52.6,26.63
N$1
  Top 1.422: OK3.1 49.21,27.11 50.38,25.94 50.38,24.52 50.36,24.5 50.38,24.5 | 50.38,24.5 | 50.38,24.5 50.25,24.63 50.31,24.63 R6.2
N$2  (1 unrouted)
  Top 0.406: Q1.3 21.33,6.84 C7.1 22.77,6.84 R10.2 23.84,7.91 25.05,7.91
N$3
  Top 0.406: C17.2 36.31,14.25 U3.14
N$4  (via drill 0.6)  (2 unrouted)
  Top 1.016: 53.55,18.1 53.3,17.85 v51.7,17.85
  Bottom 0.406: v51.7,17.84 v51.7,17.85
  Bottom 1.016: v51.7,17.84 51.38,18.16 47.14,18.16
N$5  (1 unrouted)
  Top 0.305: 31.93,27.07 31.91,27.09 R14.2 32.06,27.09 32.07,27.07 | 38.26,32.21 38.25,32.22 36.5,32.22 35.91,31.62 35.91,27.62 35.36,27.07 33.45,27.07 | 32.07,27.07 31.95,27.07 | 32.07,27.07 33.45,27.07 | 33.45,27.07 R15.1
N$6  (via drill 0.6)  (1 unrouted)
  Top 0.406: 35.16,21.46 v35.15,21.45 | C18.2 41.42,21.47
  Top 0.61: 39.26,21.47 41.42,21.47 41.9,21.47 43.58,19.79 43.58,13.56 43.09,13.07 U4.P$3 42.09,12.88 C14.1 | R4.2 36.75,21.44 36.16,21.44
  Top 0.813: 39.26,21.44 36.16,21.44 35.2,21.44 35.18,21.46 | 35.18,21.46 35.17,21.47 35.16,21.47 v35.15,21.45 | 35.18,21.46 35.18,21.47 | 35.18,21.47 35.18,21.46 | 35.18,21.47 | 35.18,21.46 | 35.18,21.46 35.18,21.47 | 35.18,21.47 | 35.18,21.47 35.19,21.47 35.18,21.46 35.17,21.46 35.17,21.48 35.18,21.47
  Bottom 0.406: v35.15,21.45 35.15,22.5 34.15,23.5 32.75,23.5 32.6,23.35
  Bottom 0.813: L1.P$2 32.48,23 33.66,23
  Bottom 1.016: L1.P$2 32.15,23.34 32.59,23.34 32.6,23.35 32.59,23.35 | 32.59,23.35 | 32.59,23.35 32.45,23.49 31.96,23.49 31.96,23.48 | 32.6,23.35 32.47,23.48 31.96,23.48 | 31.96,23.48 | 31.96,23.48 31.95,23.5 31.93,23.5 31.94,23.5 31.97,23.5 31.98,23.49 L1.P$2 31.98,23.48 31.97,23.48 31.97,23.47 31.95,23.48 31.95,23.5 | 33.66,23.29 33.66,23 35.18,21.49 35.18,21.51
N$7
  Top 0.305: PWR.+ R3.2
N$8
  Top 0.406: Q2.1 31.95,28.66 R14.1
N$9  (via drill 0.7)
  Top 1.27: 39.15,8.54 C15.2 39.07,8.37 39.92,7.51 45.22,7.51 47.79,10.08 v47.97,10.08
  Bottom 1.27: v47.97,10.08 47.94,10.11 47.94,12.32 47.87,12.25 L2.P$2
N$10  (1 unrouted)
  Top 0.305: IC1.16 14.19,12.61 14.25,12.55
N$11
  Top 0.61: U3.10 37.08,9.17 | 37.08,9.17 38.04,10.13 40.25,10.13 40.3,10.08 40.3,9.91 C11.1 40.75,9.45 C14.2 | 37.08,9.17 36.89,8.98 | 36.89,8.98 36.89,8.73 36.89,8.56 | 36.89,8.56 36.89,6.32 37.05,6.16 D6.C | 36.36,9.1 36.89,8.56 | 36.89,8.56 36.89,8.55 | 36.89,8.98 36.87,8.96 | 36.89,8.56
N$12
  Top 0.254: 16.03,29.42 16.04,29.42 R13.2
  Top 0.61: R13.2 16.06,31.14 U1.3 | D3.C 9.66,4.49 8.95,3.78 5.35,3.78 4.87,4.27 4.87,12.36 3.14,14.09 3.14,20.21 10.84,27.91 15.29,27.91 16.03,28.65 16.03,29.42 16.01,29.44
N$13  (1 unrouted)
  Top 0.406: R20.2 38.4,13.2 38.4,14.71 38.74,15.05 R23.1 38.06,16.66 Q3.3
N$14
  Top 0.406: Q1.1 18.74,8.59 20,9.86 21.73,9.86 C10.2 22.34,9.8 R10.1 23.58,9.17 U3.7
N$15  (1 unrouted)
  Top 0.305: R16.2 29.55,29.67 R17.2 29.86,30.81 31.31,32.26 32.89,32.26 Q2.3 32.98,32.25 33.04,32.3 33.04,32.83 34.42,34.21
N$17
  Top 1.27: 52.72,13.08 52.36,13.08 47.72,17.72 R9.2 47.5,22.19 47.5,22.92 | 52.72,13.08 U4.P$4 | F1.P$2 52.84,12.96 52.72,13.08 | R6.1 47.5,23.3 47.5,22.92 | R8.P$1 47.45,22.87 | 47.45,22.87 47.52,22.87 arc90 47.55,22.9 | 47.5,22.92 arc-90 47.45,22.87
N$18
  Top 0.406: R21.2 38.37,11.63 40.27,11.63 | 39.97,18.23 R19.1 40.04,18.25 | C11.2 40.27,11.63 | 40.27,11.63 40.27,15.98 | 40.27,15.98 40.27,16.09 40.29,16.09 40.06,16.32 40.06,18.24 40.05,18.24 40.04,18.25 | 40.04,18.25 39.61,18.68 38.62,18.68 | 38.62,18.68 38.59,18.68 | Q3.1 38.62,18.68 | R23.2 40.27,15.98
N$19
  Top 0.406: Q3.2 36.12,18.25 R18.1
PD  (1 unrouted)
  Top 0.305: U3.15 33.36,15.52 32.62,16.26 32.62,18.19 33.19,18.75 33.2,18.75 R5.2 33.19,18.73 | 33.19,18.73 | 33.19,18.73 33.18,18.72
RESET  (via drill 0.3, 0.6)  (3 unrouted)
  Top 0.305: U2.29 28.05,25.39 | 28.05,25.39 28.52,25.39 29.4,24.5 30.38,25.48 31.68,25.48 32.4,24.76 v32.4,21.53 | R2.2 27.96,25.47 28.05,25.39 | J4.11 22.3,2.68 23.31,3.69 | v49,6.16 46.54,3.7 23.34,3.7
  Bottom 0.254: RESET.P$1 14.79,0.67 21.66,0.67 22.3,1.31 22.3,1.99
  Bottom 0.305: v32.4,21.53 33.58,20.35 34.81,20.35 v49,6.16
VBUS  (via drill 0.3)  (2 unrouted)
  Top 0.305: IC1.8 9.83,9.27 9.85,9.25
  Top 0.406: v8.74,7.63 9.4,7.63 D3.A
  Top 0.61: 9.85,9.25 9.85,7.56 D3.A 9.66,7.41 9.7,7.45
  Top 0.813: 13.46,23.38 9.96,23.38 8.01,21.42 8.01,17.21 6.58,15.78 5.62,15.78 J1.1
  Bottom 0.305: J5.1 4.91,7.21 4.9,7.2 | 8.74,7.58 8.74,7.43 8.31,7 4.33,7
  Bottom 0.406: 4.9,7.2 8.31,7.2 v8.74,7.63
  Bottom 0.813: J1.1 5.62,14.29 9.07,10.85 9.07,7.96 v8.74,7.63
XTAL1  (1 unrouted)
  Top 0.254: R1.2 19.68,30.83
  Top 0.406: U2.7 19.61,30.76 19.68,30.83 20.1,31.25 20.1,32.55 20.15,32.55
XTAL2
  Top 0.254: R1.1 18.12,30.36 18.1,30.33
  Top 0.406: U2.8 18.1,29.99 18.1,30.33 Y1.3

### Text on the board
tPlace: C4 | D3 | D2 | GND | GND | 3V3 | D9 | D8 | D7 | D6 | D5 | D4 | L | HIGH VOLTAGE! | N | 5V DC in | - | +5V | HIGH VOLTAGE! | Q1 | D1 | D0 | RST | D12 | D11 | D10 | A0 | A1 | A2 | A3 | A4 | A5 | D13
bPlace: GND | GND | 3V3 | D3 | D2 | D9 | D8 | D7 | D6 | D5 | D4 | L | +5V DC in | HIGH | VOLTAGE! | N | Maduino | Power Line Modem v1.2 | - | www.makerfabs.com | + | +5V | D1 | D0 | D13 | D11 | A0 | A1 | A2 | A3 | A4 | A5 | RST | D12 | D10